# Altium schematic sheet BK5811.SchDoc
size A4
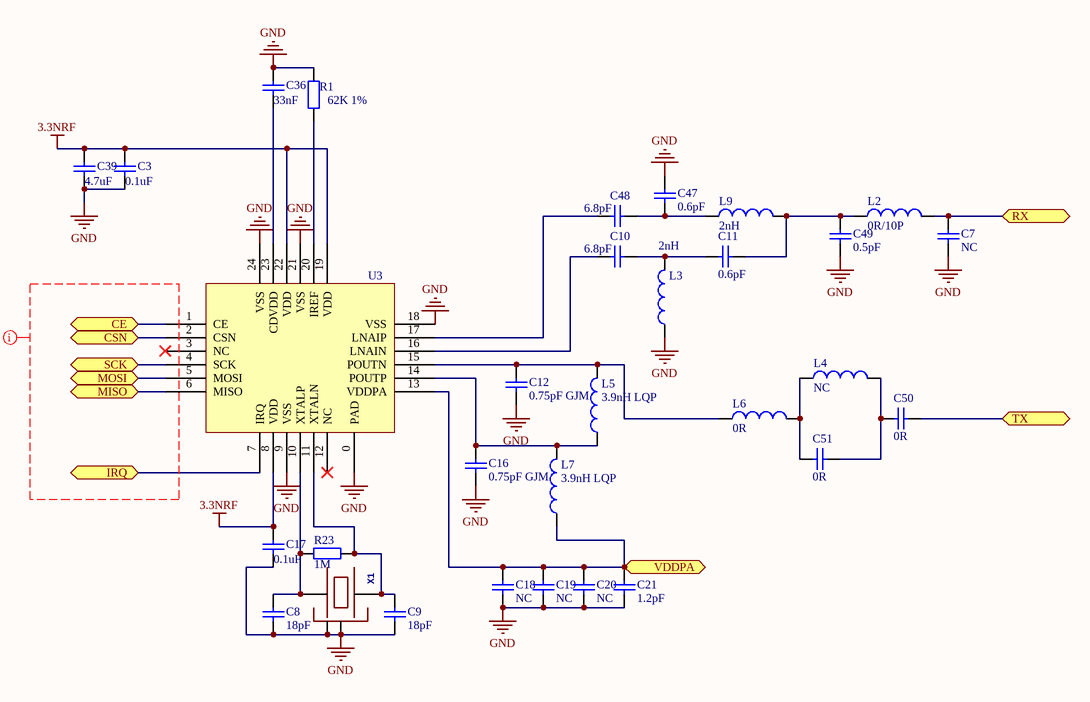
[diagram p0: BK5811.SchDoc]

## Parts
C3  0.1uF  [0402]
C7  NC  [0402]
C8  value 18pF  [0402]  (hidden comment: Cap)
C9  value 18pF  [0402]  (hidden comment: Cap)
C10  6.8pF  [0402]
C11  0.6pF  [0402]
C12  0.75pF GJM  [0402]
C16  0.75pF GJM  [0402]
C17  0.1uF  [0402]
C18  NC  [0402]
C19  NC  [0402]
C20  NC  [0402]
C21  1.2pF  [0402]
C36  33nF  [0402]
C39  4.7uF  [0603]
C47  0.6pF  [0402]
C48  6.8pF  [0402]
C49  0.5pF  [0402]
C50  0R  [0402]
C51  0R  [0402]
L2  0R/10P  [0402]
L3  2nH  [0402]
L4  NC  [0402]
L5  3.9nH LQP  [0402]
L6  0R  [0402]
L7  3.9nH LQP  [0402]
L9  2nH  [0402]
R1  62K 1%  [0402]
R23  value 1M  [0402]  (hidden comment: Res2)
U3  BK5811  [BK5811]  (value not drawn)
X1  16Mhz  [OSCILLATOR-3.2X2.5]  (value not drawn)

## Ports
CE, CSN, IRQ, MISO, MOSI, RX, SCK, TX, VDDPA

## Nets
3.3NRF: C3.2 C17.2 C39.2 U3.8(VDD) U3.19(VDD) U3.22(VDD)
GND: C3.1 C7.1 C8.2 C9.2 C12.1 C16.1 C17.1 C18.2 C19.2 C20.2 C21.2 C36.2 C39.1 C47.2 C49.1 L3.1 R1.2 U3.0(PAD) U3.9(VSS) U3.18(VSS) U3.21(VSS) U3.24(VSS) X1.2(NC_2) X1.4(NC_4)
CE: U3.1(CE) ; port CE
CSN: U3.2(CSN) ; port CSN
IRQ: U3.7(IRQ) ; port IRQ
MISO: U3.6(MISO) ; port MISO
MOSI: U3.5(MOSI) ; port MOSI
RX: C7.2 L2.2 ; port RX
SCK: U3.4(SCK) ; port SCK
TX: C50.2 ; port TX
VDDPA: C18.1 C19.1 C20.1 C21.1 L7.1 U3.13(VDDPA) ; port VDDPA
NetC8_1: C8.1 R23.2 U3.10(XTALP) X1.1
NetC9_1: C9.1 R23.1 U3.11(XTALN) X1.3
NetC10_1: C10.1 U3.16(LNAIN)
NetC10_2: C10.2 C11.2 L3.2
NetC11_1: C11.1 C49.2 L2.1 L9.2
NetC12_2: C12.2 L5.2 L6.1 U3.15(POUTN)
NetC16_2: C16.2 L5.1 L7.2 U3.14(POUTP)
NetC36_1: C36.1 U3.23(CDVDD)
NetC47_1: C47.1 C48.2 L9.1
NetC48_1: C48.1 U3.17(LNAIP)
NetC50_1: C50.1 C51.2 L4.2
NetC51_1: C51.1 L4.1 L6.2
NetR1_1: R1.1 U3.20(IREF)

Not connected (* = marked no-connect by the designer): U3 3(NC)* 12(NC)*

## Layout directives
net class BK5811_SPI: (no net found under the mark)

## Library data of the parts
C3 C7-C12 C16-C21 C36 C39 C47-C51 = Cap: Capacitor; Published: 8-Jun-2000; LatestRevisionDate: 17-Jul-2002; LatestRevisionNote: Re-released for DXP Platform.; PackageReference: RAD-0.3; Publisher: Altium Limited; PackageDescription: Radial Cap, Thru-Hole; 2 Leads; 0.3 in Pin Spacing
L2-L7 L9 = Inductor: Code_IEC: 1005; Published: 8-Jun-2000; LatestRevisionDate: 29-May-2009; LatestRevisionNote: IPC-7351 Footprint Added.; PackageReference: 0402-A; Publisher: Altium Limited; PackageDescription: Chip Inductor; Code_JEITA: 0402
R1 R23 = Res2: Resistor; Published: 8-Jun-2000; LatestRevisionDate: 17-Jul-2002; LatestRevisionNote: Re-released for DXP Platform.; PackageReference: AXIAL-0.4; Publisher: Altium Limited; PackageDescription: Axial Device, Thru-Hole; 2 Leads; 0.4 in Pin Spacing
X1 = OSCILLATOR-3.2X2.5: Crystal Oscillator in 3.2x2.5 SMD